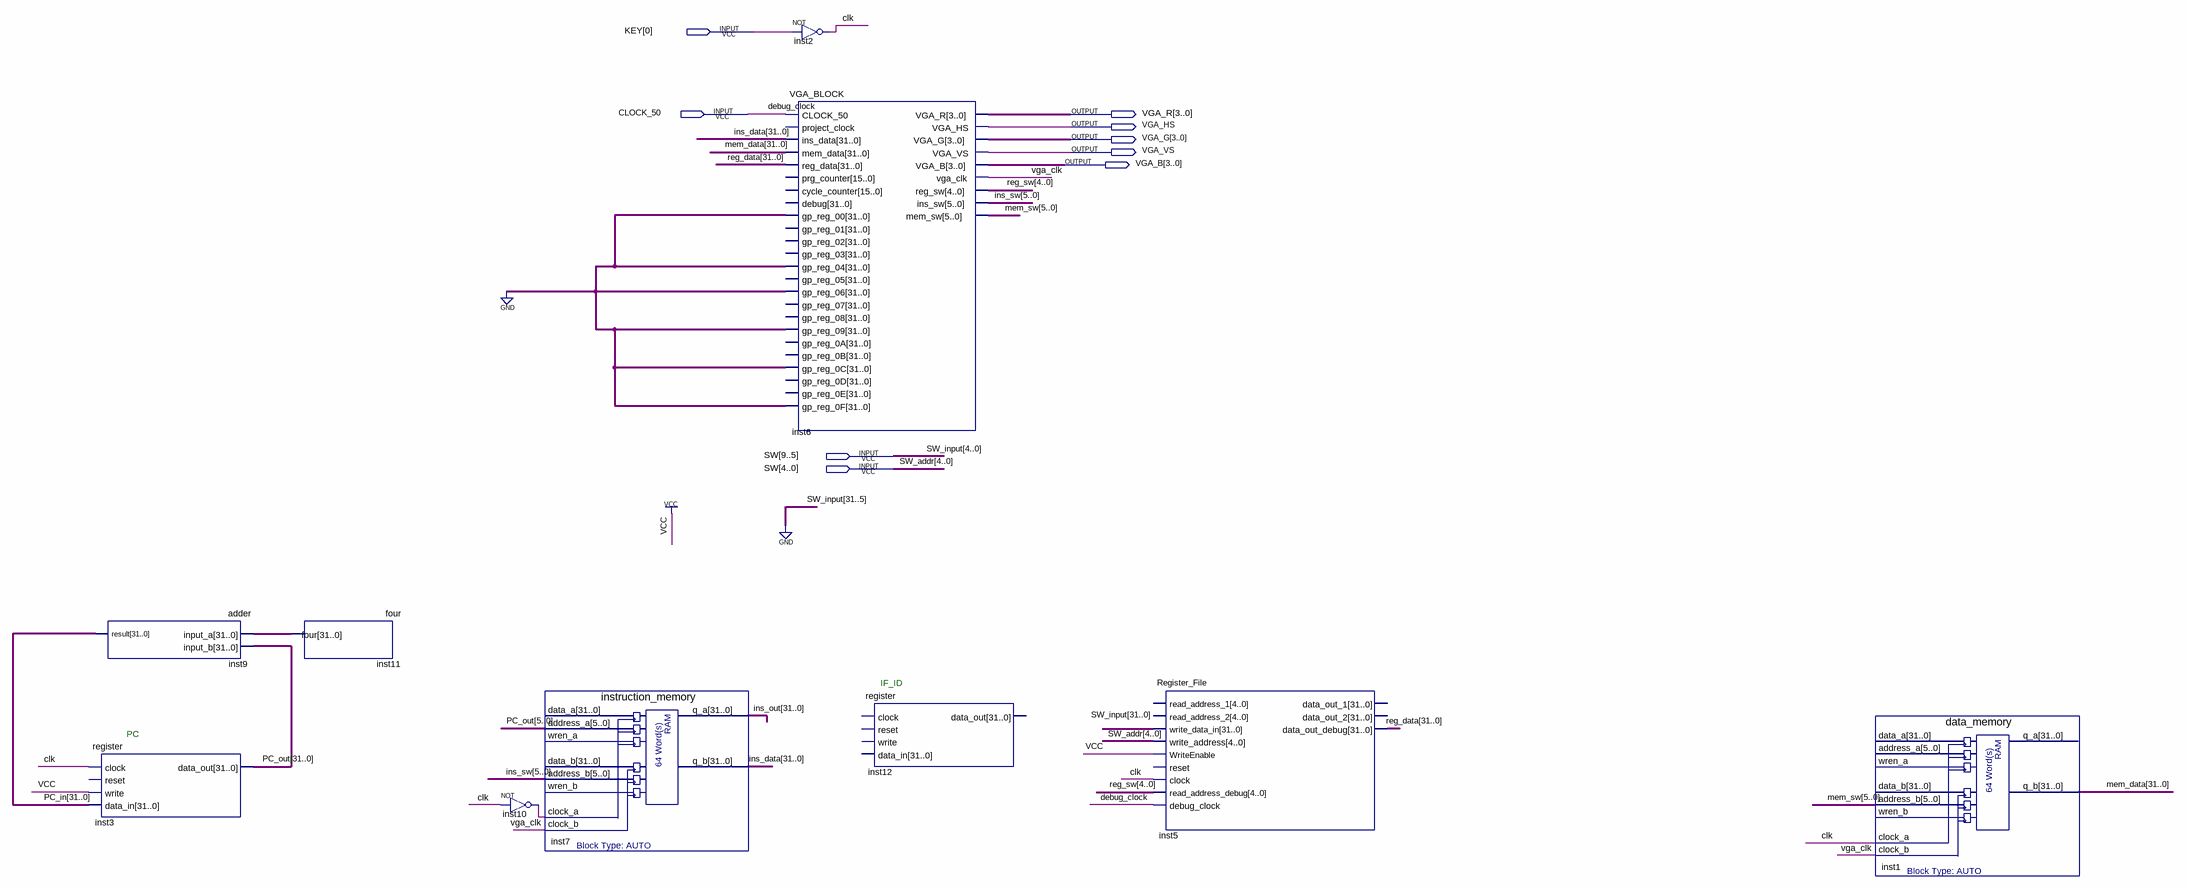
[diagram p0: schematic sheet]
// Quartus schematic Register_File_and_Memory.bdf as structural Verilog: 10 symbols, 9 pins
module Register_File_and_Memory (
  input  [0:0] KEY,
  input  CLOCK_50,
  input  [9:0] SW,
  output [3:0] VGA_R,
  output VGA_HS,
  output [3:0] VGA_G,
  output VGA_VS,
  output [3:0] VGA_B
);

  wire clk, inst10_out, vga_clk;
  wire [4:0] reg_sw;
  wire [5:0] ins_sw, mem_sw;
  wire [31:0] ins_data, ins_out, inst11_four, mem_data, PC_in, PC_out, reg_data;

  adder inst9 (.input_a(inst11_four), .input_b(PC_out), .result(PC_in));
  register inst3 (.clock(clk), .write(1'b1), .data_in(PC_in), .data_out(PC_out));  // open: reset
  four inst11 (.four(inst11_four));
  not inst10 (inst10_out, clk);
  instruction_memory inst7 (
    .address_a(PC_out[5:0]), .address_b(ins_sw), .clock_a(inst10_out), .clock_b(vga_clk), .q_a(ins_out),
    .q_b(ins_data));  // open: data_a, wren_a, data_b, wren_b
  not inst2 (clk, KEY[0]);
  VGA_BLOCK inst6 (
    .CLOCK_50(CLOCK_50), .ins_data(ins_data), .mem_data(mem_data), .reg_data(reg_data),
    .gp_reg_00({32{1'b0}}), .gp_reg_04({32{1'b0}}), .gp_reg_06({32{1'b0}}), .gp_reg_09({32{1'b0}}),
    .gp_reg_0C({32{1'b0}}), .gp_reg_0F({32{1'b0}}), .VGA_R(VGA_R), .VGA_HS(VGA_HS), .VGA_G(VGA_G),
    .VGA_VS(VGA_VS), .VGA_B(VGA_B), .vga_clk(vga_clk), .reg_sw(reg_sw), .ins_sw(ins_sw), .mem_sw(mem_sw));  // open: project_clock, prg_counter, cycle_counter, debug, gp_reg_01, gp_reg_02, gp_reg_03, gp_reg_05, gp_reg_07, gp_reg_08, gp_reg_0A, gp_reg_0B, gp_reg_0D, gp_reg_0E
  register inst12 ();  // open: clock, reset, write, data_in, data_out
  Register_File inst5 (
    .write_data_in({{27{1'b0}}, SW[9:5]}), .write_address(SW[4:0]), .WriteEnable(1'b1), .clock(clk),
    .read_address_debug(reg_sw), .debug_clock(CLOCK_50), .data_out_debug(reg_data));  // open: read_address_1, read_address_2, reset, data_out_1, data_out_2
  data_memory inst1 (
    .address_b(mem_sw), .clock_a(clk), .clock_b(vga_clk), .q_b(mem_data));  // open: data_a, address_a, wren_a, data_b, wren_b, q_a

  // Other names for the same wires on the sheet: debug_clock = CLOCK_50; SW_addr[4:0] = SW[4:0];
  //   SW_input[4:0] = SW[9:5]

  // Notes on the sheet:
  //   IF_ID
  //   PC
endmodule
